# Altium project Portable Lamp Remote v2.PrjPcb
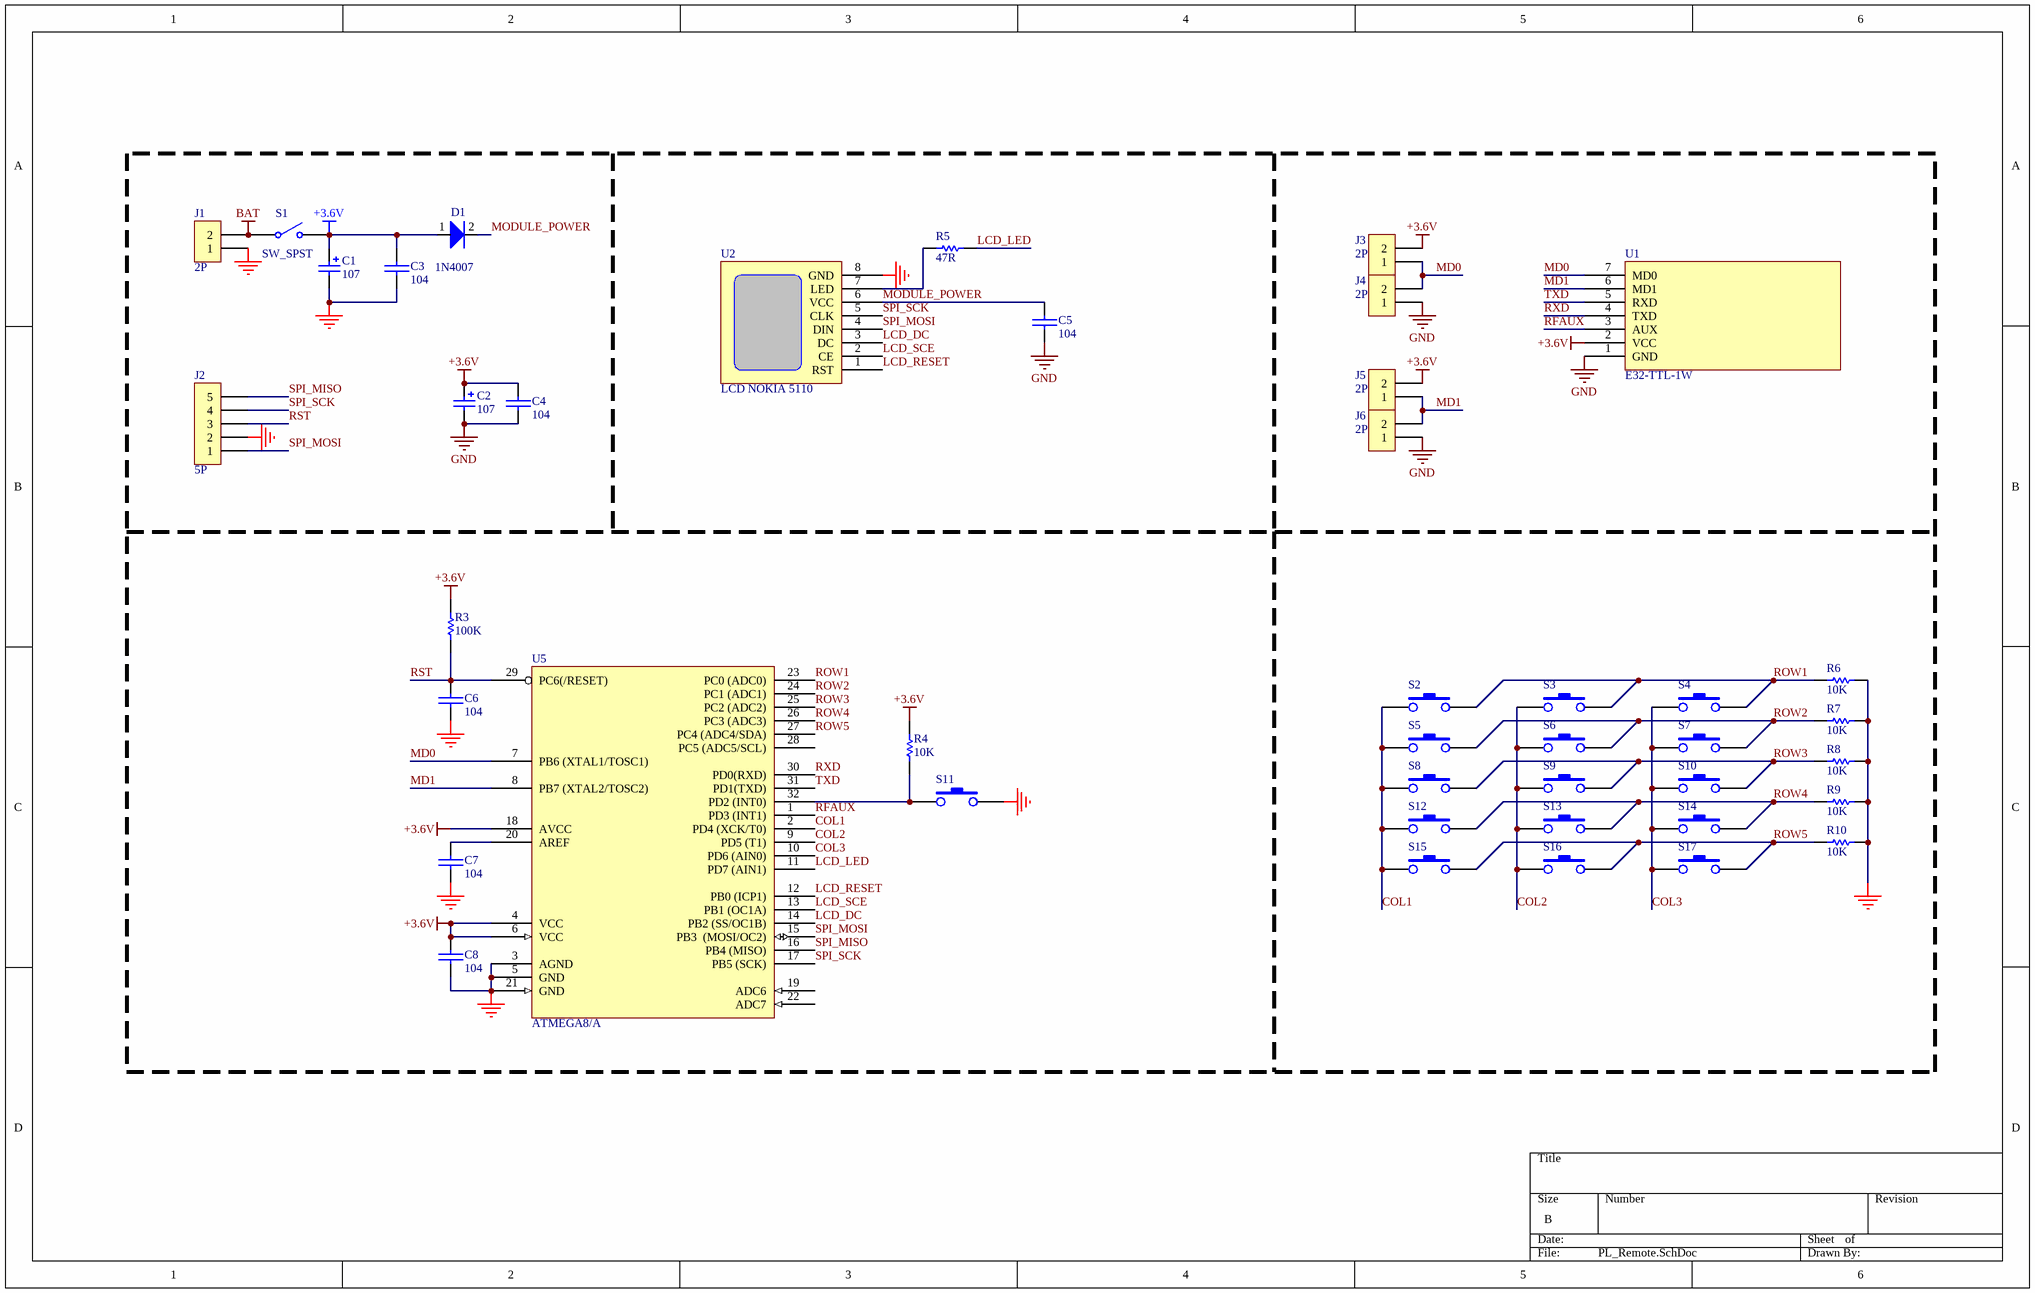
[diagram p0: PL_Remote.SchDoc]
1 sheet, 43 parts. Net scope: global (net labels, ports and power ports of the same name join across sheets).
Board files: PL_Remote.PcbDoc, PL_Remote Ghep.PcbDoc

## Sheet PL_Remote.SchDoc
size B

### Parts
C1  value 107  [SMC_D/WA]
C2  value 107  [SMC_E/WA]
C3  value 104  [0805C]
C4  value 104  [0805C]
C5  value 104  [0805C]
C6  value 104  [0805C]
C7  value 104  [0805C]
C8  value 104  [0805C]
D1  Value2: 1N4007  [SMC_D/WA]
J1  value 2P  [HDR1x2]
J2  value 5P  [HDR1x5]  (hidden comment: Jump đực chân thẳng, 2.54mm 5P)
J3  value 2P  [XPAD]
J4  value 2P  [XPAD]
J5  value 2P  [XPAD]
J6  value 2P  [XPAD]
R3  value 100K  [0805DD]
R4  value 10K  [0805DD]
R5  value 47R  [0805DD]
R6  value 10K  [0805DD]
R7  value 10K  [0805DD]
R8  value 10K  [0805DD]
R9  value 10K  [0805DD]
R10  value 10K  [0805DD]
S1  value SW_SPST  [SPST-2]  (hidden comment: Công tắc chân cắm BIT X1)
S2  (no value)  [CHIP]
S3  (no value)  [CHIP]
S4  (no value)  [CHIP]
S5  (no value)  [CHIP]
S6  (no value)  [CHIP]
S7  (no value)  [CHIP]
S8  (no value)  [CHIP]
S9  (no value)  [CHIP]
S10  (no value)  [CHIP]
S11  (no value)  [CHIP]
S12  (no value)  [CHIP]
S13  (no value)  [CHIP]
S14  (no value)  [CHIP]
S15  (no value)  [CHIP]
S16  (no value)  [CHIP]
S17  (no value)  [CHIP]
U1  value E32-TTL-1W  [RF_AS32]
U2  LCD NOKIA 5110  [NOKIA5110T]
U5  value ATMEGA8/A  [ATMEGA8]

### Nets
+3.6V: C1.1 C2.1 C3.1 C4.2 C8.1 D1.1(A) J3.2 J5.2 R3.2 R4.2 S1.2(NO) U1.2(VCC) U5.4(VCC) U5.6(VCC) U5.18(AVCC)
BAT: J1.2 S1.1(COMMON)
GND: C1.2 C2.2 C3.2 C4.1 C5.2 C6.2 C7.2 C8.2 J1.1 J2.2 J4.1 J6.1 R6.2 R7.2 R8.2 R9.2 R10.2 S11.2 U1.1(GND) U2.8(GND) U5.3(AGND) U5.5(GND) U5.21(GND)
COL1: S2.1 S5.1 S8.1 S12.1 S15.1 U5.2(PD4_(XCK/T0))
COL2: S3.1 S6.1 S9.1 S13.1 S16.1 U5.9(PD5_(T1))
COL3: S4.1 S7.1 S10.1 S14.1 S17.1 U5.10(PD6_(AIN0))
LCD_DC: U2.3(DC) U5.14(PB2_(SS/OC1B))
LCD_LED: R5.2 U5.11(PD7_(AIN1))
LCD_RESET: U2.1(RST) U5.12(PB0_(ICP1))
LCD_SCE: U2.2(CE) U5.13(PB1_(OC1A))
MD0: J3.1 J4.2 U1.7(MD0) U5.7(PB6_(XTAL1/TOSC1))
MD1: J5.1 J6.2 U1.6(MD1) U5.8(PB7_(XTAL2/TOSC2))
MODULE_POWER: C5.1 D1.2(K) U2.6(VCC)
RFAUX: U1.3(AUX) U5.1(PD3_(INT1))
ROW1: R6.1 S2.2 S3.2 S4.2 U5.23(PC0_(ADC0))
ROW2: R7.1 S5.2 S6.2 S7.2 U5.24(PC1_(ADC1))
ROW3: R8.1 S8.2 S9.2 S10.2 U5.25(PC2_(ADC2))
ROW4: R9.1 S12.2 S13.2 S14.2 U5.26(PC3_(ADC3))
ROW5: R10.1 S15.2 S16.2 S17.2 U5.27(PC4_(ADC4/SDA))
RST: C6.1 J2.3 R3.1 U5.29(PC6(/RESET))
RXD: U1.4(TXD) U5.30(PD0(RXD))
SPI_MISO: J2.5 U5.16(PB4_(MISO))
SPI_MOSI: J2.1 U2.4(DIN) U5.15(PB3__(MOSI/OC2))
SPI_SCK: J2.4 U2.5(CLK) U5.17(PB5_(SCK))
TXD: U1.5(RXD) U5.31(PD1(TXD))
NetC7_1: C7.1 U5.20(AREF)
NetR4_1: R4.1 S11.1 U5.32(PD2_(INT0))
NetR5_1: R5.1 U2.7(LED)

Not connected (* = marked no-connect by the designer): U5 19(ADC6) 22(ADC7) 28(PC5_(ADC5/SCL))

### Library data of the parts
C1 C2 = Cap Pol1: Polarized Capacitor (Radial); Type1: Tụ hóa chân cắm; Type2: Tụ hóa chân dán; Published: *; LatestRevisionDate: *; LatestRevisionNote: *; PackageReference: *; Publisher: *
C3-C8 = CAP: Type1: Tụ điện dán 0805; Type2: Tụ điện chân cắm
D1 = DIODE: Type1: Diode xung chân cắm 3A; Type2: Diode chỉnh lưu chân cắm 1A; Type3: Diode chỉnh lưu chân cắm 3A; Type4: Diode chân dán 1A; Value: 1N5822
J1 J3-J6 = CON2: Type1: Giắc xanh loại nằm, 300V/16A - 5.08mm; Type2: Jump đực loại thẳng, 2.54mm; Type3: Jumper; Type4: Giắc xanh loại nằm, 300V/16A - 3.81mm
J2 = CON5: Connector
R3-R10 = RES semi: Semiconductor Resistor; Type1: Điện trở dán 0805; Type2: Điện trở chân cắm 1/4W; Type3: Điện trở chân cắm 2W; Published: *; LatestRevisionDate: *; LatestRevisionNote: *; PackageReference: *; Publisher: *
S1 = SW-SPST: Single-Pole, Single-Throw Switch; Published: 24-Mar-1999; LatestRevisionDate: 17-Jul-2002; LatestRevisionNote: Re-released for DXP Platform.; PackageReference: SPST-2; Publisher: Altium Limited; PackageDescription: Switch; 2 Leads
S2-S17 = SW-PB: Type1: Công tắc chip chân cắm, 4 chân; Value: 6x6x4mm
U1 = AS32-TTL-1W: Type1: Module thu phát không dây RF
U5 = ATMEGA8-A: TQFP package; Type1: Vi điều khiển ATMEL chân dán